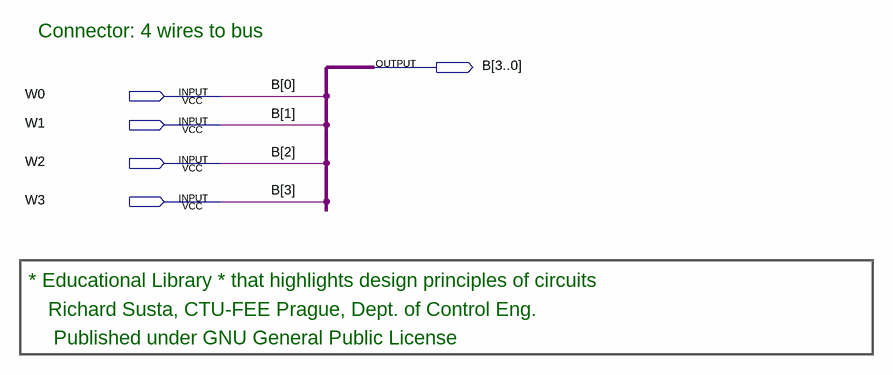
[diagram p0: schematic sheet]
// Quartus schematic join4wires.bdf as structural Verilog: 0 symbols, 5 pins
module join4wires (
  input  W0,
  input  W1,
  input  W2,
  input  W3,
  output [3:0] B
);


  assign B = {W3, W2, W1, W0};

  // Notes on the sheet:
  //   Connector: 4 wires to bus
  //   * Educational Library * that highlights design principles of circuits
  //   Richard Susta, CTU-FEE Prague, Dept. of Control Eng. 
  //    Published under GNU General Public License
endmodule
